# Altium schematic sheet LED_DRIVER.SchDoc
size A3; SheetNumber: 5; SheetTotal: 7
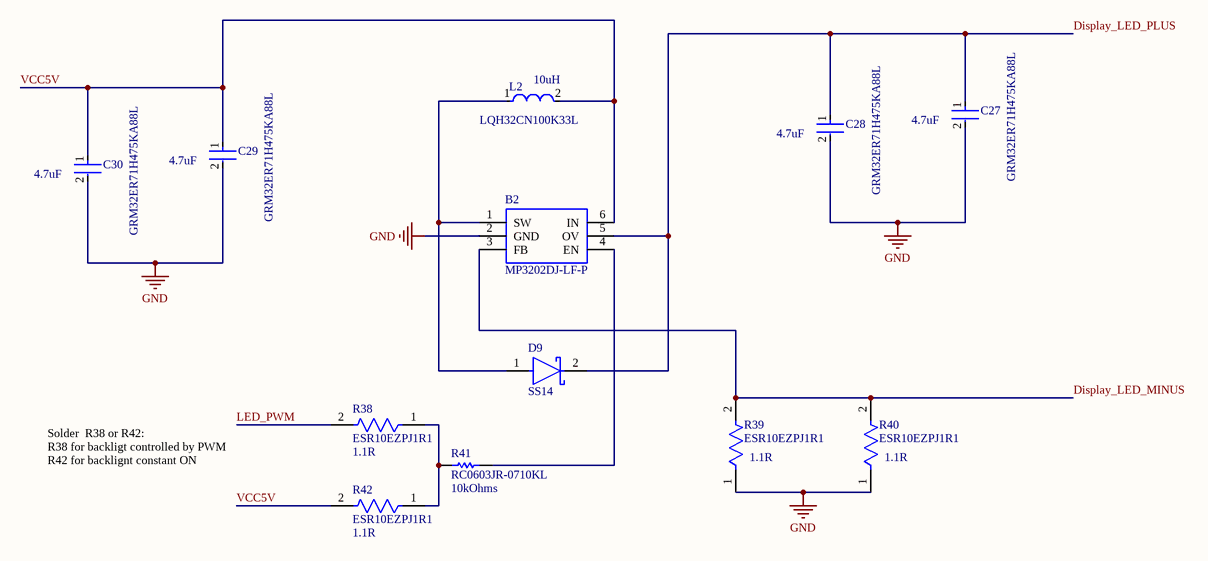
[diagram p0: LED_DRIVER.SchDoc]

## Parts
B2  MP3202DJ-LF-P  [SOT95P280X100-6N]
C27  GRM32ER71H475KA88L  value 4.7uF  [FP-GRM32-MFG]
C28  GRM32ER71H475KA88L  value 4.7uF  [FP-GRM32-MFG]
C29  GRM32ER71H475KA88L  value 4.7uF  [FP-GRM32-MFG]
C30  GRM32ER71H475KA88L  value 4.7uF  [FP-GRM32-MFG]
D9  SS14  [FP-403AE-MFG]
L2  LQH32CN100K33L  Inductance: 10uH  [FP-LQH32CH_33-A2_3_2_8-MFG]
R38  ESR10EZPJ1R1  Resistance: 1.1R  [FP-ESR10-IPC_A]
R39  ESR10EZPJ1R1  Resistance: 1.1R  [FP-ESR10-IPC_A]
R40  ESR10EZPJ1R1  Resistance: 1.1R  [FP-ESR10-IPC_A]
R41  RC0603JR-0710KL  Resistance: 10kOhms  [RESC1608X55X25ML10T15]
R42  ESR10EZPJ1R1  Resistance: 1.1R  [FP-ESR10-IPC_A]

## Nets
GND: B2.2(GND) C27.2 C28.2 C29.2 C30.2 R39.1 R40.1
Display_LED_MINUS: B2.3(FB) R39.2 R40.2
Display_LED_PLUS: B2.5(OV) C27.1 C28.1 D9.2(C)
LED_PWM: R38.2
VCC5V: B2.6(IN) C29.1 C30.1 L2.2 R42.2
NetB2_1: B2.1(SW) D9.1(A) L2.1
NetB2_4: B2.4(EN) R41.1
NetR38_1: R38.1 R41.2 R42.1

## Notes on the sheet
- Solder  R38 or R42:
  R38 for backligt controlled by PWM
  R42 for backlignt constant ON

## Library data of the parts
B2 = MP3202DJ-LF-P: Monolithic Power Systems (MPS) MP3202DJ-LF-P LED Driver IC, 2.5  6 V 6-Pin; Geometry.Height: 1mm; Mouser Part Number: 946-MP3202DJLFP; Mouser Price/Stock: https://www.mouser.co.uk/ProductDetail/Monolithic-Power-Systems-MPS/MP3202DJ-LF-P?qs=rC7bBWoQAAnkWXT%252BwQ2sJQ%3D%3D; Manufacturer_Name: Monolithic Power Systems (MPS); Manufacturer_Part_Number: MP3202DJ-LF-P; Datasheet Link: http://www.monolithicpower.com/DesktopModules/DocumentManage/API/Document/GetDocument?id=1215
C27-C30 = CMP-1038-02162-3: CAP CER 4.7UF 50V X7R 1210; Manufacturer: Murata; Tolerance: 10%; Temperature Coefficient: 15%; Material: Ceramic; Lead Free: Yes; ComponentLink2Description: Datasheet; Capacitance: 4.7uF; Digikey Description: CAP CER 4.7UF 50V X7R 1210; Category: Cap; Automotive: No; ComponentLink2URL: https://search.murata.co.jp/Ceramy/image/img/A01X/G101/ENG/GRM32ER71H475KA88-01A.pdf; Package: GRM32; Device Class L2: Capacitors; Voltage Rating: 50V; Device Class L1: Passive Components; Mouser Description: Capacitor Capacitance tolerance: ±10% Ceramic type: X7R Construction form: 1210 Capacitance: 4.7 µF Rated voltage: 50...; Octopart: https://octopart.com/grm32er71h475ka88l-murata-196576; Temperature: -55°C to +125°C; Temperature Range Low: -55°C; Height: 2.7mm; Manufacturer Part Number: GRM32ER71H475KA88L; Temperature Characteristic: X7R; Temperature Range High: +125°C; RoHS: TRUE; Device Class L3: Ceramic Capacitors
D9 = CMP-2000-04943-2: DIODE SCHOTTKY 40V 1A SMA; Manufacturer: ON Semiconductor; Peak Reverse Current: 0.2mA; Max Junction Temp: +125°C; Standoff Height: 0.05mm; Max Surge Forward Current: 40A; Mouser Description: Schottky Diodes & Rectifiers SMA 40V 1.0A; RoHS: TRUE; Lead Free: Yes; Manufacturer Part Number: SS14; Device Class L3: Schottky Diodes; Category: Diode; Automotive: No; Digikey Description: DIODE SCHOTTKY 40V 1A SMA; ComponentLink2Description: Datasheet; Device Class L2: Diodes; Height: 2.5mm; Temperature Range High: +125°C; ComponentLink2URL: https://www.onsemi.com/pub/Collateral/SS19-D.PDF; Device Class L1: Discrete Semiconductors; Package: 403AE; Octopart: https://octopart.com/ss14-on+semiconductor-29205033; Max Repetitive Reverse Voltage: 40V; Temperature Range Low: -65°C; Forward Current: 1A; Temperature: -65°C to +125°C
L2 = CMP-06042-000202-2: Wire Wound Ferrite Inductor for Power Lines 10μH ±10% 0.39Ω 450mA 1210; Shielding: Unshielded; DC Resistance (DCR): 34mR; Self Resonant Frequency: 26MHz; Test Frequency: 1MHz; Q Factor: 35; Current: 1.25A; Parameter 1: Inductance; Number of Pins: 2; Inductance Tolerance: 10%; Max Operating Temperature: 85°C; Tolerance: 10%; Case Code (Imperial): 1210; Series: LQH32C_33; Height: 2mm; DC Current: 450mA; Min Operating Temperature: -25°C; Current Rating: 450mA; Case Code (Metric): 3225; Core Material: Ferrite; Width: 2.5mm; Length: 3.2mm; REACH SVHC: No SVHC; Radiation Hardening: No; Depth: 2.7mm; Termination: SMD/SMT; Rated Current-Max: 450mA; Inductor Type: Wirewound; Package Quantity: 1; Packaging: Tape and Reel; Max DC Current: 450mA; Lead Free: Lead Free; Military Standard: Not; Mount: Surface Mount; Weight: 0.002116oz; Case/Package: 1210
R38-R40 R42 = CMP-08839-028421-1: 1.1Ω ±5% 0.4W 0805 Anti-Surge Chip Resistor AEC-Q200; Max Power Dissipation: 400mW; Temperature Coefficient: 200ppm/°C; Packaging: Tape and Reel; Max Operating Temperature: 155°C; Case Code (Imperial): 0805; Case/Package: 0805; Package Quantity: 1; Width: 0.049inch; Length: 0.079inch; Resistor Type: Thick Film; Case Code (Metric): 2012; Number of Terminations: 2; RoHS Compliant: Yes; Min Operating Temperature: -55°C; Tolerance: 5%; Series: ESR; Features: Automotive AEC-Q200; Height: 0.026inch
R41 = CMP-2000-05022-1: Resistor, 10 KOhm, +/- 5%, 100 mW, -55 to 155 degC, 0603 (1608 Metric), RoHS, Tape and Reel; Manufacturer: Yageo; Voltage Rating: 50V; Temperature Coefficient: 100PPM/C; Power Rating: 100mW; Package Reference: 603; Series: RC; Case Code - mm: 1608; Packaging: Reel; Datasheet URL: http://www.farnell.com/datasheets/443971.pdf; Datasheet Version: Rev. 4, 04/2009; Operating Temperature Range: -55Cto+155C; Product: ThickFilmResistorsGeneralPurpose; Package Description: 2-Pin Surface Mount Device, Body 1.6 x 0.8 mm; Manufacturer URL: http://www.yageo.com/; Case Code - in: 0603; Tolerance: 5%; Termination Style: SMD/SMT